# EAGLE design SpringReverb (EAGLE 9.6.2)
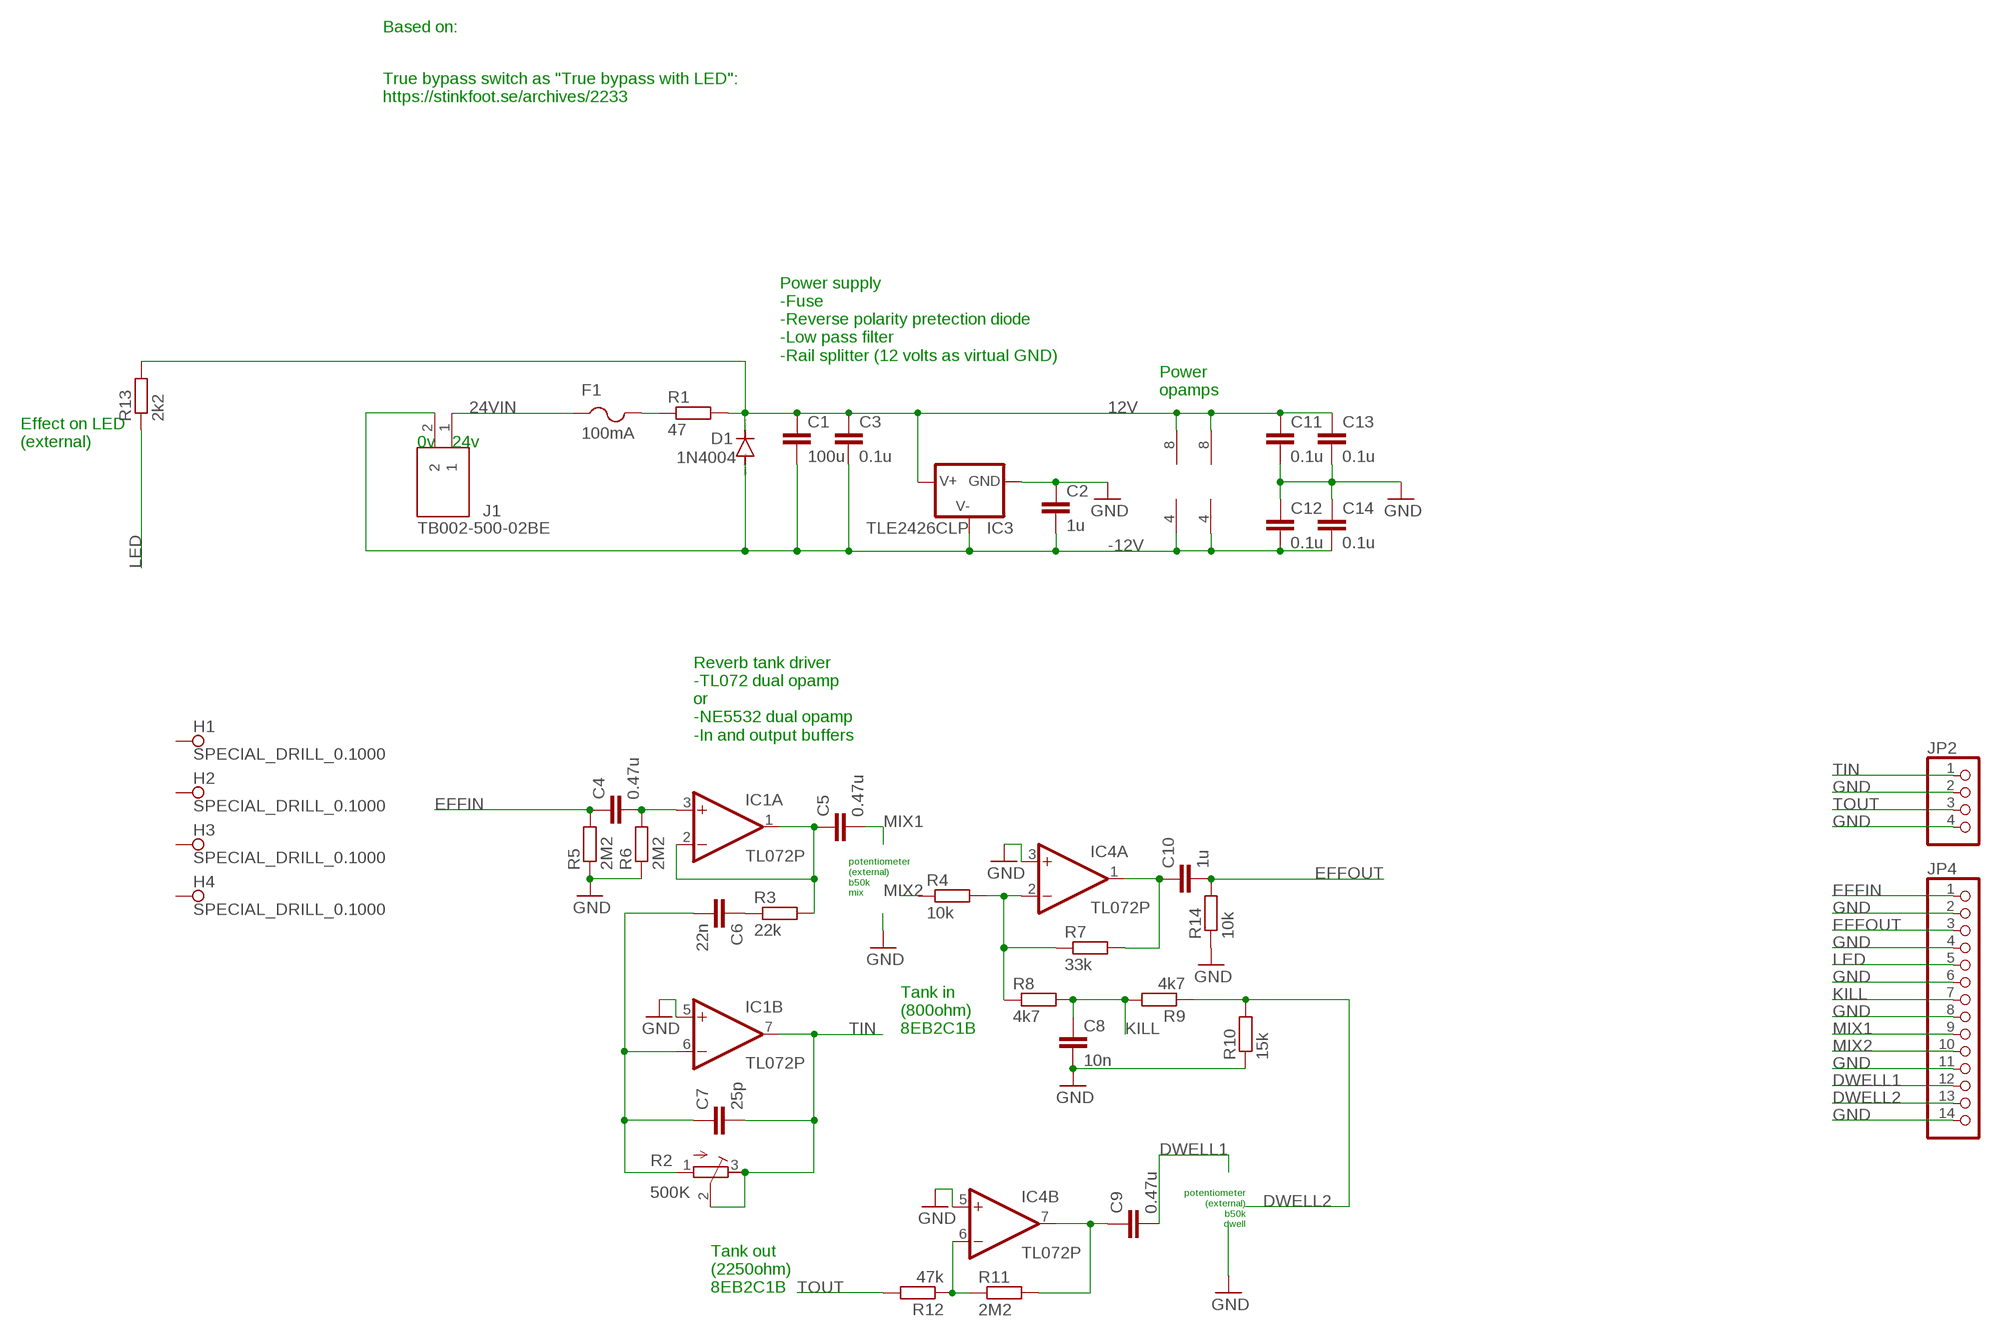
[diagram p0: schematic, sheet 1]

## Parts
C1  100u  C-EUC1206  [C1206]
C2  1u  C-EUC1206  [C1206]
C3  0.1u  C-EUC0603  [C0603]
C4  0.47u  C-EUC1206  [C1206]
C5  0.47u  C-EUC1206  [C1206]
C6  22n  C-EUC0603  [C0603]
C7  25p  C-EUC1206  [C1206]
C8  10n  C-EUC1206  [C1206]
C9  0.47u  C-EUC1206  [C1206]
C10  1u  C-EUC1206  [C1206]
C11  0.1u  C-EUC0603  [C0603]
C12  0.1u  C-EUC0603  [C0603]
C13  0.1u  C-EUC0603  [C0603]
C14  0.1u  C-EUC0603  [C0603]
D1  1N4004  [DO41-10]
F1  100mA  PTCFUSE-1812  [1812]
H1  SPECIAL_DRILL_0.1000  [PAD_0.1000]
H2  SPECIAL_DRILL_0.1000  [PAD_0.1000]
H3  SPECIAL_DRILL_0.1000  [PAD_0.1000]
H4  SPECIAL_DRILL_0.1000  [PAD_0.1000]
IC1  TL072P  [DIL08]
IC3  TLE2426CLP  [TO92LP]
IC4  TL072P  [DIL08]
J1  TB002-500-02BE  [CUI_TB002-500-02BE]
JP2  PINHD-1X4  [1X04]
JP4  PINHD-1X14  [1X14]
R1  47  R-EU_R0603  [R0603]
R2  500K  R-TRIMM3296W  [RTRIM3296W]
R3  22k  R-EU_R0603  [R0603]
R4  10k  R-EU_R0603  [R0603]
R5  2M2  R-EU_R1206  [R1206]
R6  2M2  R-EU_R1206  [R1206]
R7  33k  R-EU_R0603  [R0603]
R8  4k7  R-EU_R0603  [R0603]
R9  4k7  R-EU_R0603  [R0603]
R10  15k  R-EU_R1206  [R1206]
R11  2M2  R-EU_R1206  [R1206]
R12  47k  R-EU_R0603  [R0603]
R13  2k2  R-EU_R0603  [R0603]
R14  10k  R-EU_R0603  [R0603]

## Nets
12V: C1.1 C3.1 C11.1 C13.1 D1.C IC1.8(P:V+) IC3.IN IC4.8(P:V+) R1.2 R13.2
24VIN: F1.1 J1.1
-12V: C1.2 C2.2 C3.2 C12.2 C14.2 D1.A IC1.4(P:V-) IC3.GND IC4.4(P:V-) J1.2
DWELL1: C9.2 JP4.12
DWELL2: JP4.13 R9.1 R10.2
EFFIN: C4.1 JP4.1 R5.2
EFFOUT: C10.2 JP4.3 R14.2
GND: C2.1 C8.2 C11.2 C12.1 C13.2 C14.1 IC1.5(B:+IN) IC3.OUT IC4.3(A:+IN) IC4.5(B:+IN) JP2.2 JP2.4 JP4.2 JP4.4 JP4.6 JP4.8 JP4.11 JP4.14 R5.1 R6.1 R10.1 R14.1
KILL: C8.1 JP4.7 R8.2 R9.2
LED: JP4.5 R13.1
MIX1: C5.2 JP4.9
MIX2: JP4.10 R4.1
N$3: C4.2 IC1.3(A:+IN) R6.2
N$4: F1.2 R1.1
N$6: C5.1 IC1.1(A:OUT) IC1.2(A:-IN) R3.2
N$7: C6.1 R3.1
N$8: C6.2 C7.1 IC1.6(B:-IN) R2.1(A)
N$12: IC4.2(A:-IN) R4.2 R7.1 R8.1
N$13: C10.1 IC4.1(A:OUT) R7.2
N$15: C9.1 IC4.7(B:OUT) R11.2
N$20: IC4.6(B:-IN) R11.1 R12.1
TIN: C7.2 IC1.7(B:OUT) JP2.1 R2.2(S) R2.3(E)
TOUT: JP2.3 R12.2
Unconnected: H1.1 H2.1 H3.1 H4.1

## Notes on the sheet
- Based on:
- True bypass switch as "True bypass with LED":
  https://stinkfoot.se/archives/2233
- Power supply
  -Fuse
  -Reverse polarity pretection diode
  -Low pass filter
  -Rail splitter (12 volts as virtual GND)
- Power
  opamps
- Effect on LED
  (external)
- 0v | 24v
- Reverb tank driver
  -TL072 dual opamp
  or
  -NE5532 dual opamp
  -In and output buffers
- potentiometer
  (external)
  b50k
  mix
- Tank in
  (800ohm)
  8EB2C1B
- potentiometer
  (external)
  b50k
  dwell
- Tank out
  (2250ohm)
  8EB2C1B

## Library data of the parts
C1-C14 = rcl:C-EU: CAPACITOR, European symbol; SPICEPREFIX: C
D1 = diode:1N4004: DIODE general purpose rectifier, 1 A
F1 = adafruit:PTCFUSE: PTC fuses, resettable thermistors
H1-H4 = special-drill:SPECIAL_DRILL_: Special drills
IC1 IC4 = linear:TL072: OP AMP
IC3 = TLE2426CLP:TLE2426CLP: ACTIVE EARTH Regulator creates active GND at half way between V+ and V-
J1 = TB002-500-02BE:TB002-500-02BE; MANUFACTURER: CUI; STANDARD: Manufacturer Recommendations
JP2 = pinhead:PINHD-1X4: PIN HEADER
JP4 = pinhead:PINHD-1X14: PIN HEADER
R1 R3-R14 = rcl:R-EU_: RESISTOR, European symbol; SPICEPREFIX: R
R2 = rcl:R-TRIMM: Trimm resistor; SPICEMODEL: X; SPICEPREFIXL: POT

## Board
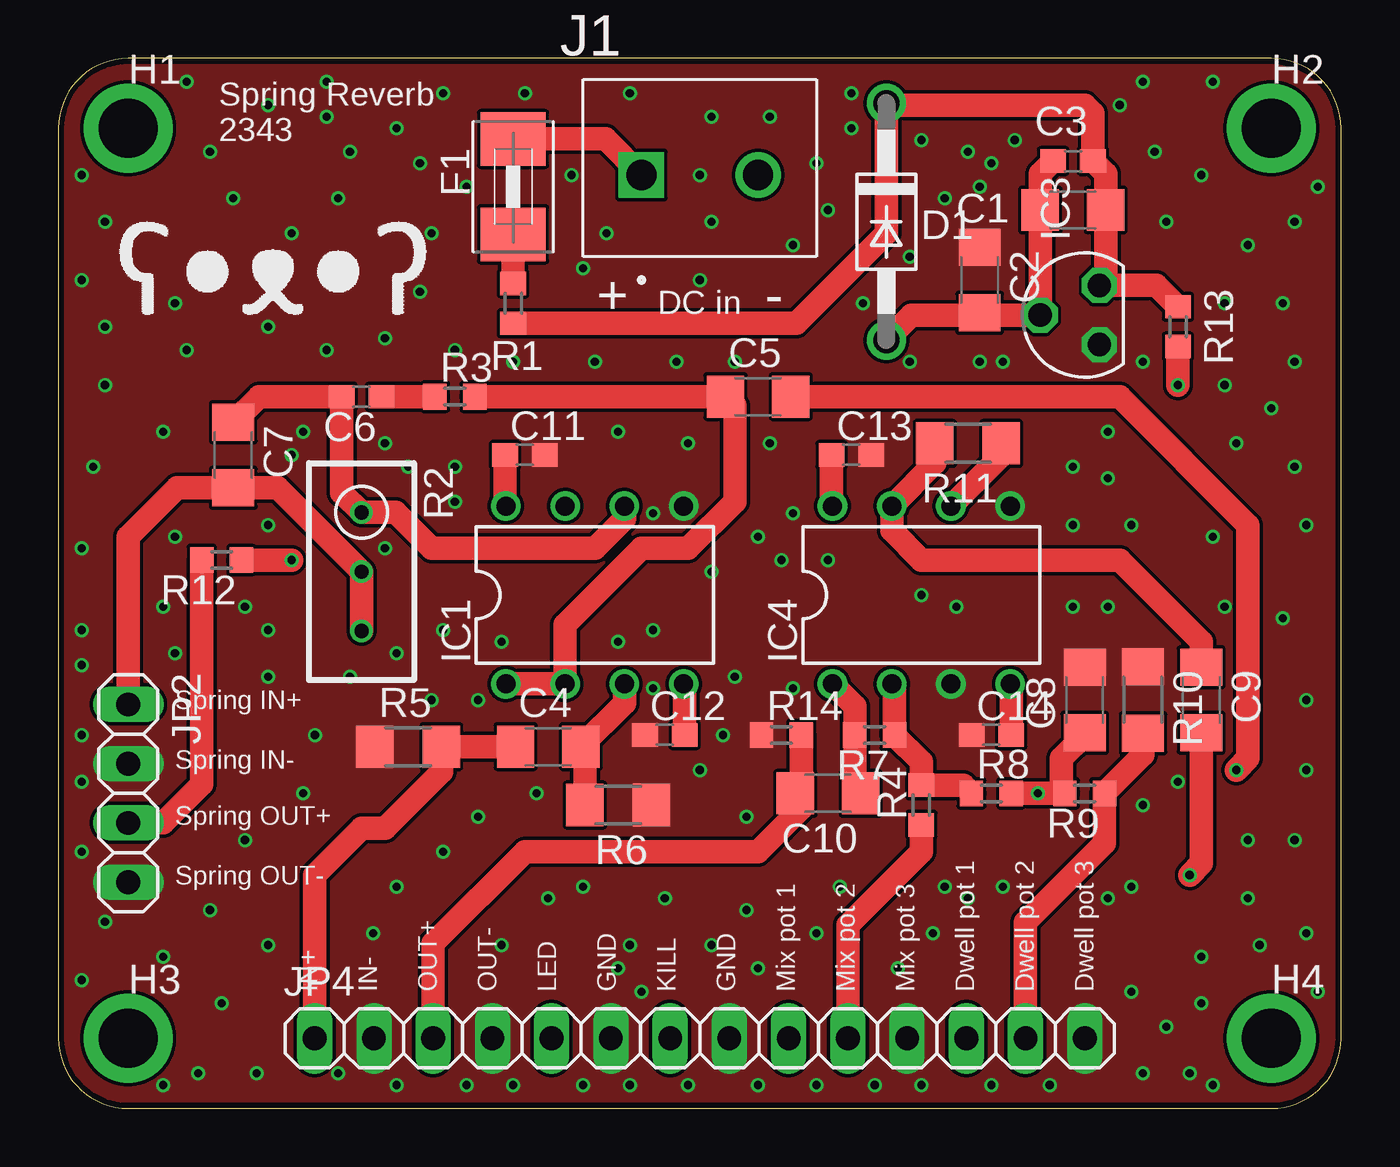
[diagram p1: board, top side]
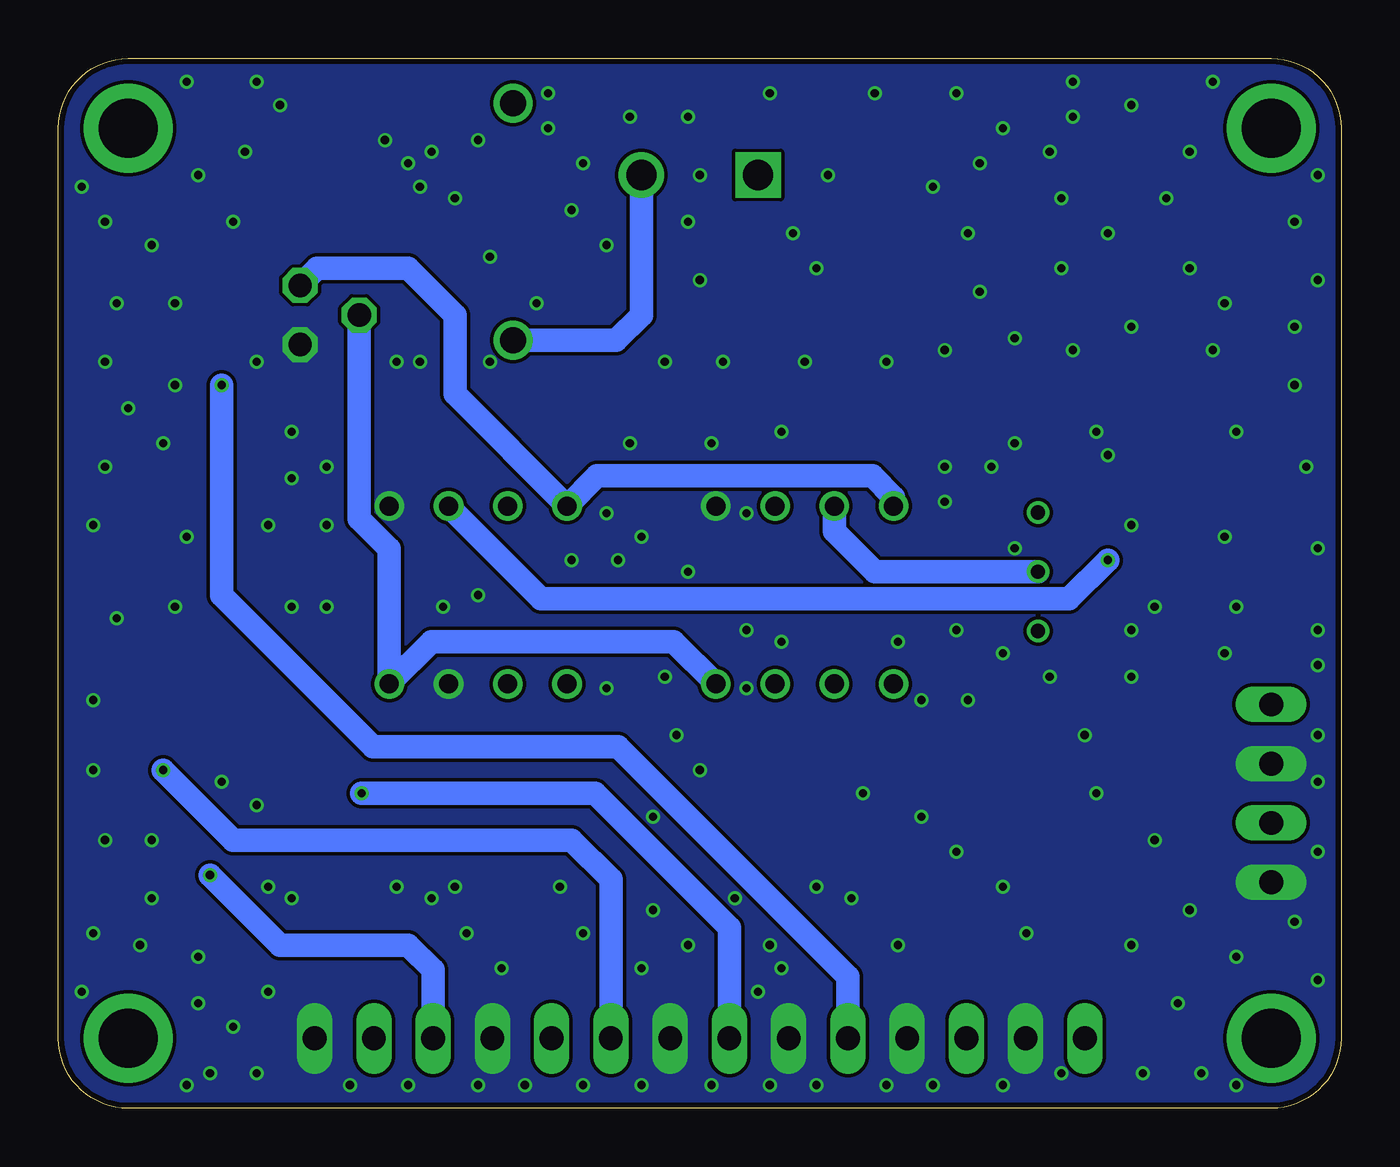
[diagram p2: board, bottom side, seen from below]

Size 55 x 45 mm. Coordinates in mm from the lower left corner, seen from the top.
Outline: 0,42 0,3 arc90 3,0 52,0 arc90 55,3 55,42 arc90 52,45 3,45 arc90 0,42
Copper layers (1*16): Top 0.018mm / dielectric 1.55mm / Bottom 0.018mm
Design rules "eC_2Layer_PClass6_BaseCopperO18_eCDefault": minimum track width 0.15mm, minimum drill 0.35mm, track to track 0.15mm, track to pad 0.15mm, pad to pad 0.15mm, via to via 0.15mm, smd to smd 0mil, copper to edge 0.25mm, drill to drill 0.35mm, minimum pad ring 0.175mm, minimum via ring 0.125mm, stop-mask expansion 0mil, vias tented up to drill 0.45mm, thermal gap 0.2mm

### Footprints (pad centres in the part's own frame; a part is rotated, then mirrored left to right if it is on the bottom)
C1206 = smd 1.6 x 1.8: 1 -1.4,0; 2 1.4,0
C0603 = smd 1.1 x 1: 1 -0.85,0; 2 0.85,0
DO41-10 = drill 1.118: A 5.08,0; C -5.08,0
1812 = smd 2.286 x 2.794: 1 -2.046,0; 2 2.046,0
PAD_0.1000 = drill 2.54 pad 2.54: 1 0,0
DIL08 = drill 0.813 pad 1.27: 1 -3.81,-3.81; 2 -1.27,-3.81; 3 1.27,-3.81; 4 3.81,-3.81; 5 3.81,3.81; 6 1.27,3.81; 7 -1.27,3.81; 8 -3.81,3.81
TO92LP = drill 1 octagon: GND 0,1.905; IN 1.27,-0.635; OUT -1.27,-0.635
CUI_TB002-500-02BE = drill 1.3 square: 1 0,0 | drill 1.3: 2 5,0
1X04 = drill 1.016 long: 1 -3.81,0; 2 -1.27,0; 3 1.27,0; 4 3.81,0
1X14 = drill 1.016 long: 1 -16.51,0; 2 -13.97,0; 3 -11.43,0; 4 -8.89,0; 5 -6.35,0; 6 -3.81,0; 7 -1.27,0; 8 1.27,0; 9 3.81,0; 10 6.35,0; 11 8.89,0; 12 11.43,0; 13 13.97,0; 14 16.51,0
R0603 = smd 1 x 1.1: 1 -0.85,0; 2 0.85,0
RTRIM3296W = drill 0.61: 1 0,-2.54; 2 0,0; 3 0,2.54
R1206 = smd 1.6 x 1.803: 1 -1.422,0; 2 1.422,0

### Placement (x,y rotation side)
C1  43.5,38.5 180 top
C2  39.5,35.5 270 top
C3  43.5,40.6 180 top
C4  21,15.5 0 top
C5  30,30.5 0 top
C6  13,30.5 180 top
C7  7.5,28 270 top
C8  44,17.5 90 top
C9  49,17.5 270 top
C10  33,13.5 180 top
C11  20,28 0 top
C12  26,16 0 top
C13  34,28 0 top
C14  40,16 0 top
D1  35.5,38 270 top
F1  19.5,39.5 270 top
H1  3,42 0 top
H2  52,42 0 top
H3  3,3 0 top
H4  52,3 0 top
IC1  23,22 0 top
IC3  44,34 90 top
IC4  37,22 0 top
J1  25,40 0 top
JP2  3,13.5 270 top
JP4  27.5,3 0 top
R1  19.5,34.5 270 top
R2  13,23 180 top
R3  17,30.5 0 top
R4  37,13 90 top
R5  15,15.5 0 top
R6  24,13 180 top
R7  35,16 180 top
R8  40,13.5 0 top
R9  44,13.5 180 top
R10  46.5,17.5 270 top
R11  39,28.5 180 top
R12  7,23.5 180 top
R13  48,33.5 90 top
R14  31,16 0 top

### Tracks (layer width: path | path; a pad name or v marks a point on that pad's centre or on a via)
12V
  Top 1.016: R1.2 31.65,33.65 35.5,37.5 D1.C 35.58,43 44,43 44.35,42.65 C3.1 44.9,40.05 C1.1 44.9,35.53 IC3.IN 47.08,35.27 R13.2 | IC1.8 19.15,25.85 C11.1 | IC4.8 33.15,25.85 C13.1
  Bottom 1.016: IC3.IN 43.91,36 40,36 38,34 38,30.62 IC4.8 31.9,27.1 20.1,27.1 19.19,26.19 IC1.8
24VIN
  Top 1.016: F1.1 23.45,41.55 J1.1
-12V
  Top 1.016: C2.2 39.6,34 | 39.6,34 IC3.GND C1.2 42.1,40.05 C3.2 | IC4.4 40.85,18.15 C14.2 | IC1.4 26.85,18.15 C12.2 | D1.A 36.58,34 39.6,34
  Bottom 1.016: D1.A 31.08,32.92 30,34 J1.2 | IC1.4 28.62,20 39,20 IC4.4 40.81,23.98 42.1,25.27 42.1,26.35 42.09,26.35 IC3.GND
DWELL1  (via drill 0.35)
  Top 1.016: C9.2 49,10.5 v48.5,10
  Bottom 1.016: v48.5,10 45.5,7 40,7 38.93,5.93 JP4.12
DWELL2
  Top 1.016: R10.2 46.5,15.15 R9.1 44.85,11.35 41.47,7.97 JP4.13
EFFIN
  Top 1.016: C4.1 R5.2 16.42,14.42 14,12 13,12 10.99,9.99 JP4.1
EFFOUT
  Top 1.016: R14.2 31.85,13.25 | 31.85,13.25 C10.2 | JP4.3 16.07,7.07 20,11 30,11 31.85,12.85 31.85,13.25
GND  (via drill 0.35)
  other vias: 2,31 5.5,32.5 10,37.5 12,36 6.5,36 9,33.5 11.5,32.5 12.5,41 6.5,41 7.5,39 2,38 4.5,29 1.5,27.5 1,20.5 2,8 1,14 6,1.5 6.5,8.5 7,4.5 14.5,9.5 13.5,7.5 10.5,13.5 8,11.5 9,18.5 4.5,21.5 5,19.5 9,25 10,28 10.5,29 17,32.5 15.5,35 15.5,40.5 12,39 20,43.5 28,42.5 24.5,43.5 23.5,37.5 22,40 22.5,36 27.5,35.5 28,38 27.5,40 30.5,42.5 34,43.5 32.5,40.5 34,42 31.5,37 39.5,39.5 37,41.5 40,40.5 46.5,44 49.5,44 47,41 51,37 47.5,38 49,40 52.5,34.5 50,31 50,34.5 52,30 53,38 36.5,36.5 34.5,34.5 30.5,28.5 24,29 17,27.5 14,28.5 15,27.5 16.5,20.5 19,20 16,17.5 12.5,18.5 11,16 18,12.5 16.5,11 20.5,13.5 27.5,14.5 29,18.5 28.5,16 31.5,18 30,24.5 31.5,25.5 31,23.5 33,23.5 38.5,21.5 37,22 25.5,20.5 24,20 46,9.5 45,9 40.5,9.5 39,9 37.5,7.5 36,6 33.5,9.5 32.5,7.5 29.5,8.5 30,6 28,7 21,9 22.5,9.5 19,7 24,6 24.5,7 25,5 46,5 47.5,3.5 51.5,7 53,11.5 51,11.5 53.5,7.5 49,6.5 48.5,1.5 42.5,1 30,1 22.5,1 14.5,1 19.5,1 27,1 35,1 40,1 8.5,1.5 9,7 4.5,6.5 1,5.5 1,11 1,16 1,19 1,24 2,33.5 5,34.5 14,33 17.5,39.5 23,32 26.5,32 19.5,32 9,20.5 8,21.5 5,24.5 17,26 27,28.5 28,23 43.5,21.5 45,21.5 43.5,25 43.5,27.5 46,25 45,27 45,29 46.5,32 39.5,32 40.5,32 38,39 39,41 54,39.5 53,27.5 50.5,28.5 49.5,24.5 50,21.5 52.5,21 53.5,25 53.5,17.5 48,14 46.5,13 53.5,14.5 51,9 54,5 49,4.5 38,9.5 29.5,12.5 26,9 25.5,18 18,17.5 14,24 14.5,19.5 25.5,25.5 16,37.5 16.5,43.5 5.5,44 11.5,42.5 11.5,44 9,43 14.5,42 53,32 36.5,32 29,32 33,38.5 41,41.5 45.5,43 12,1.5 17.5,1 24.5,1 32.5,1 37,1 46.5,1.5 49.5,1 4.5,1 1,40 1,35.5
  pour Top (no thermals): 0,45 0,0 55,0 55,45
  pour Bottom (no thermals): 0,45 0,0 55,0 55,45
KILL  (via drill 0.35)
  Top 1.016: R8.2 v42,13.5 R9.2 43,13.65 43,15 44,16 C8.1
  Bottom 1.016: JP4.7 26.23,7.73 32,13.5 v42,13.5
LED  (via drill 0.35)
  Top 1.016: v48,31 R13.1
  Bottom 1.016: JP4.5 21.15,5.65 31,15.5 41.5,15.5 48,22 v48,31
MIX1  (via drill 0.35)
  Top 1.016: C5.2 45.5,30.5 51,25 51,15 v50.5,14.5
  Bottom 1.016: v50.5,14.5 47.5,11.5 33,11.5 31.31,9.81 JP4.9
MIX2
  Top 1.016: JP4.10 33.85,7.85 37,11 R4.1
N$3
  Top 1.016: IC1.3 24.27,17.37 C4.2 22.58,15.32 R6.2
N$4
  Top 1.016: R1.1 F1.2
N$6
  Top 1.016: IC1.1 IC1.2 21.73,20.73 25,24 27,24 29,26 29,30.1 C5.1 R3.2
N$7
  Top 1.016: C6.1 R3.1
N$8
  Top 1.016: IC1.6 24.27,25.27 23,24 16,24 14.46,25.54 R2.1 12.15,26.39 C6.2 8.6,30.5 C7.1
N$12
  Top 1.016: IC4.2 35.85,18.07 R7.1 37,14.85 R4.2 38.8,13.85 R8.1
N$13
  Top 1.016: IC4.1 34.15,17.23 R7.2 34.15,13.25 C10.1
N$15
  Top 1.016: R11.2 37.58,27.66 IC4.7 35.73,24.77 37,23.5 45.5,23.5 49,20 C9.1
N$20  (via drill 0.35)
  Top 1.016: IC4.6 40.42,27.96 R11.1 | v10,23.5 R12.1
  Bottom 1.016: v10,23.5 11.67,21.83 34.29,21.83 IC4.6
TIN
  Top 1.016: R2.3 R2.2 9.4,26.6 C7.2 5.1,26.6 3,24.5 JP2.1
  Bottom 1.016: R2.2 20,23 21.73,24.73 IC1.7
TOUT
  Top 1.016: R12.2 6.15,13.88 4.5,12.23 JP2.3

### Text on the board
tPlace: Spring Reverb / 2343 | + | DC in | - | Spring IN+ | Spring IN- | Spring OUT+ | Spring OUT- | IN+ | IN- | OUT+ | OUT- | LED | GND | KILL | GND | Mix pot 1 | Mix pot 2 | Mix pot 3 | Dwell pot 1 | Dwell pot 2 | Dwell pot 3